# EAGLE design pcb1 (EAGLE 9.4.2)
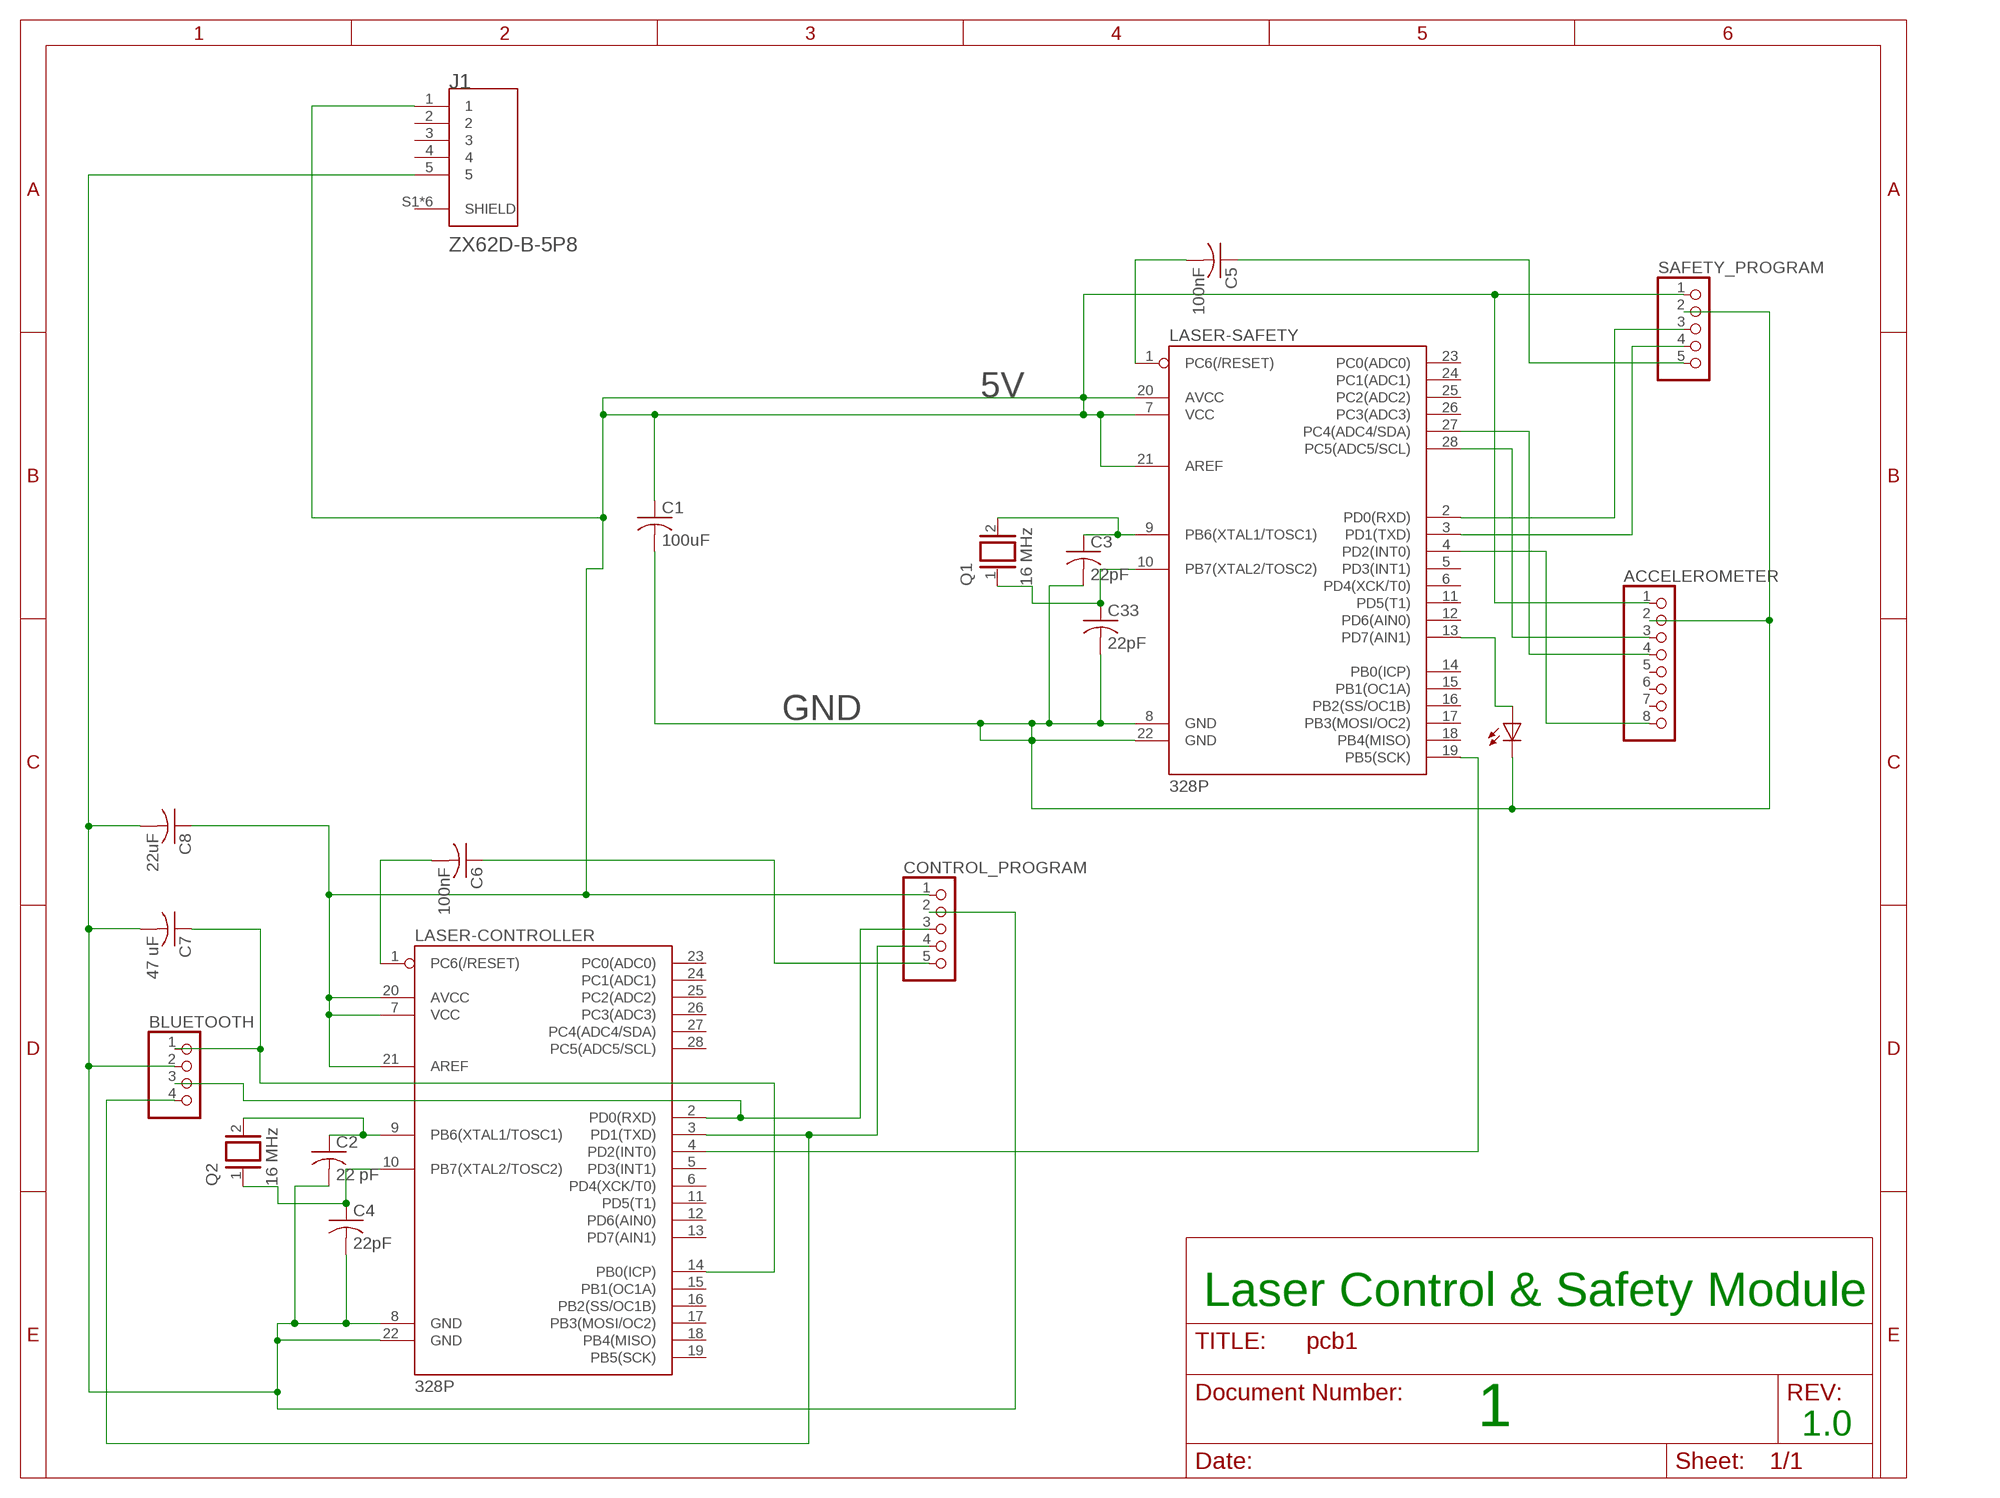
[diagram p0: schematic, sheet 1]

## Parts
ACCELEROMETER  PINHD-1X8  [1X08]
BLUETOOTH  PINHD-1X4  [1X04]
C1  100uF  C-US025-030X050  [C025-030X050]
C2  22 pF  C-US025-025X050  [C025-025X050]
C3  22pF  C-US025-025X050  [C025-025X050]
C4  22pF  C-US025-025X050  [C025-025X050]
C5  100nF  C-US025-025X050  [C025-025X050]
C6  100nF  C-US025-025X050  [C025-025X050]
C7  47 uF  C-US025-024X044  [C025-024X044]
C8  22uF  C-US025-024X044  [C025-024X044]
C33  22pF  C-US025-025X050  [C025-025X050]
CONTROL_PROGRAM  PINHD-1X5  [1X05]
J1  ZX62D-B-5P8  [HRS_ZX62D-B-5P8]
LASER-CONTROLLER  328P  ATMEGA328P_PDIP  [DIP28]
LASER-SAFETY  328P  ATMEGA328P_PDIP  [DIP28]
Q1  16 MHz  XTAL/S  [QS]
Q2  16 MHz  XTAL/S  [QS]
SAFETY_PROGRAM  PINHD-1X5  [1X05]
U$1  LEDLED3MM  [LED3MM]

## Nets
5V: ACCELEROMETER.1 C1.1 C8.1 CONTROL_PROGRAM.1 J1.1 LASER-CONTROLLER.7(VCC) LASER-CONTROLLER.20(AVCC) LASER-CONTROLLER.21(AREF) LASER-SAFETY.7(VCC) LASER-SAFETY.20(AVCC) LASER-SAFETY.21(AREF) SAFETY_PROGRAM.1
GND: ACCELEROMETER.2 BLUETOOTH.2 C1.2 C2.2 C3.2 C4.2 C7.2 C8.2 C33.2 CONTROL_PROGRAM.2 J1.5 LASER-CONTROLLER.8(GND) LASER-CONTROLLER.22(GND) LASER-SAFETY.8(GND) LASER-SAFETY.22(GND) SAFETY_PROGRAM.2 U$1.K(C)
N$1: C4.1 LASER-CONTROLLER.10(PB7(XTAL2/TOSC2)) Q2.1
N$2: LASER-SAFETY.13(PD7(AIN1)) U$1.A
N$3: LASER-CONTROLLER.4(PD2(INT0)) LASER-SAFETY.19(PB5(SCK))
N$4: C5.1 SAFETY_PROGRAM.5
N$5: C5.2 LASER-SAFETY.1(PC6(/RESET))
N$6: C2.1 LASER-CONTROLLER.9(PB6(XTAL1/TOSC1)) Q2.2
N$7: BLUETOOTH.3 CONTROL_PROGRAM.3 LASER-CONTROLLER.2(PD0(RXD))
N$9: BLUETOOTH.4 CONTROL_PROGRAM.4 LASER-CONTROLLER.3(PD1(TXD))
N$11: C6.1 CONTROL_PROGRAM.5
N$12: C6.2 LASER-CONTROLLER.1(PC6(/RESET))
N$13: ACCELEROMETER.3 LASER-SAFETY.28(PC5(ADC5/SCL))
N$14: ACCELEROMETER.4 LASER-SAFETY.27(PC4(ADC4/SDA))
N$15: ACCELEROMETER.8 LASER-SAFETY.4(PD2(INT0))
N$16: BLUETOOTH.1 C7.1 LASER-CONTROLLER.14(PB0(ICP))
N$23: LASER-SAFETY.2(PD0(RXD)) SAFETY_PROGRAM.3
N$24: C33.1 LASER-SAFETY.10(PB7(XTAL2/TOSC2)) Q1.1
N$25: C3.1 LASER-SAFETY.9(PB6(XTAL1/TOSC1)) Q1.2
N$26: LASER-SAFETY.3(PD1(TXD)) SAFETY_PROGRAM.4
Unconnected: ACCELEROMETER.5 ACCELEROMETER.6 ACCELEROMETER.7 J1.2 J1.3 J1.4 J1.S1(SHIELD) J1.S2(SHIELD) J1.S3(SHIELD) J1.S4(SHIELD) J1.S5(SHIELD) J1.S6(SHIELD) LASER-CONTROLLER.5(PD3(INT1)) LASER-CONTROLLER.6(PD4(XCK/T0)) LASER-CONTROLLER.11(PD5(T1)) LASER-CONTROLLER.12(PD6(AIN0)) LASER-CONTROLLER.13(PD7(AIN1)) LASER-CONTROLLER.15(PB1(OC1A)) LASER-CONTROLLER.16(PB2(SS/OC1B)) LASER-CONTROLLER.17(PB3(MOSI/OC2)) LASER-CONTROLLER.18(PB4(MISO)) LASER-CONTROLLER.19(PB5(SCK)) LASER-CONTROLLER.23(PC0(ADC0)) LASER-CONTROLLER.24(PC1(ADC1)) LASER-CONTROLLER.25(PC2(ADC2)) LASER-CONTROLLER.26(PC3(ADC3)) LASER-CONTROLLER.27(PC4(ADC4/SDA)) LASER-CONTROLLER.28(PC5(ADC5/SCL)) LASER-SAFETY.5(PD3(INT1)) LASER-SAFETY.6(PD4(XCK/T0)) LASER-SAFETY.11(PD5(T1)) LASER-SAFETY.12(PD6(AIN0)) LASER-SAFETY.14(PB0(ICP)) LASER-SAFETY.15(PB1(OC1A)) LASER-SAFETY.16(PB2(SS/OC1B)) LASER-SAFETY.17(PB3(MOSI/OC2)) LASER-SAFETY.18(PB4(MISO)) LASER-SAFETY.23(PC0(ADC0)) LASER-SAFETY.24(PC1(ADC1)) LASER-SAFETY.25(PC2(ADC2)) LASER-SAFETY.26(PC3(ADC3))

## Notes on the sheet
- Laser Control & Safety Module
- 1 | 1.0

## Library data of the parts
ACCELEROMETER = pinhead:PINHD-1X8: PIN HEADER
BLUETOOTH = pinhead:PINHD-1X4: PIN HEADER
C1 C3-C8 C33 = rcl:C-US: CAPACITOR, American symbol; SPICEPREFIX: C
C2 = rcl:C-US: CAPACITOR, American symbol; SPICEPREFIX: 22 pF
CONTROL_PROGRAM SAFETY_PROGRAM = pinhead:PINHD-1X5: PIN HEADER
J1 = ZX62D-B-5P8:ZX62D-B-5P8: SMD+DIP Micro USB; MICRO-B-SMD; AVAILABILITY: Unavailable; DESCRIPTION: SMD+DIP Micro USB; MICRO-B-SMD; MF: Hirose; MP: ZX62D-B-5P8; PACKAGE: None; PRICE: None
LASER-CONTROLLER LASER-SAFETY = SparkFun-IC-Microcontroller:ATMEGA328P_PDIP: Atmel 328P Through hole ATMEGA328P uC used in the Arduino 32kb flash, 1k EEPROM, 2k SRAM Datasheet <http://www.sparkfun.com/datasheets/Components/SMD/ATMega328.pdf> SparkFun Products Storefront component: AVR 28 Pin 20MHz 32K 6A/D - ATMega328P <https://www.sparkfun.com/products/9061> (COM-09061) SparkFun Simon Says - Through-Hole Soldering Kit <https://www.sparkfun.com/products/10547> (KIT-10547) SparkFun Learn to Solder - Simon Says <https://www.sparkfun.com/products/13708> (KIT-13708) SparkFun BigTime Watch Kit <https://www.sparkfun.com/products/11734> (KIT-11734) SparkFun ClockIt <https://www.sparkfun.com/products/10930> (KIT-10930) SparkFun Serial Enabled LCD Kit <https://www.sparkfun.com/products/10097> (LCD-10097) SparkFun Simon Tilts - Through Hole Soldering Kit <https://www.sparkfun.com/products/12634> (KIT-12634) SparkFun Frequency Counter Kit <https://www.sparkfun.com/products/10140> (KIT-10140) FabFM Radio Kit <https://www.sparkfun.com/products/11043> (KIT-11043) SparkFun Binary Blaster Kit <https://www.sparkfun.com/products/12037> (KIT-12037) SparkFun Metro-Gnome <https://www.sparkfun.com/products/9236> (KIT-09236) ATmega328 with Arduino Optiboot (Uno) <https://www.sparkfun.com/products/10524> (DEV-10524); PROD_ID: IC-09136
Q1 Q2 = special:XTAL/S: CRYSTAL
U$1 = Clean-Kong:LED

## Board
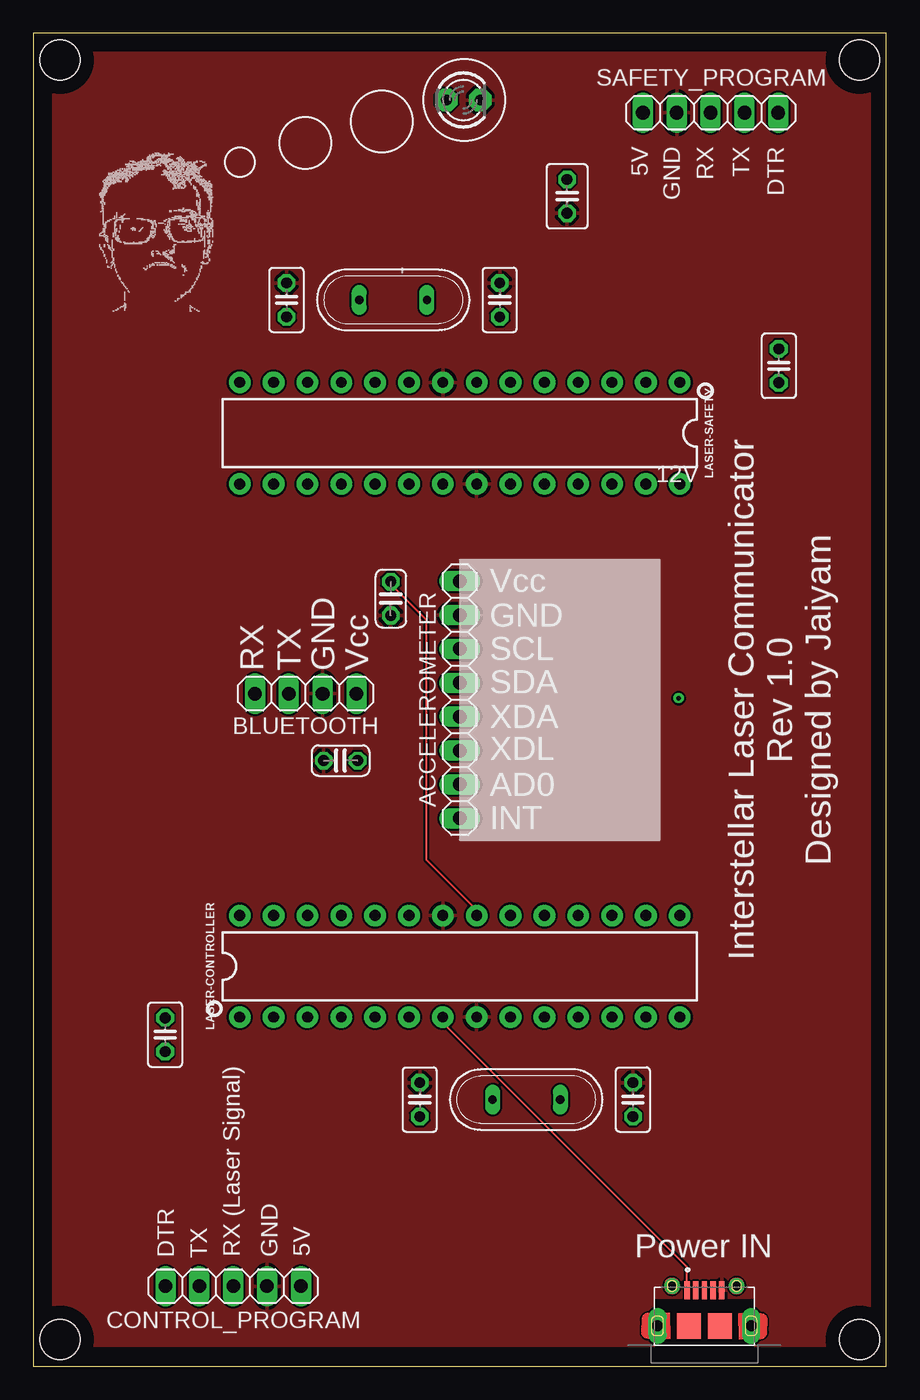
[diagram p1: board, top side]
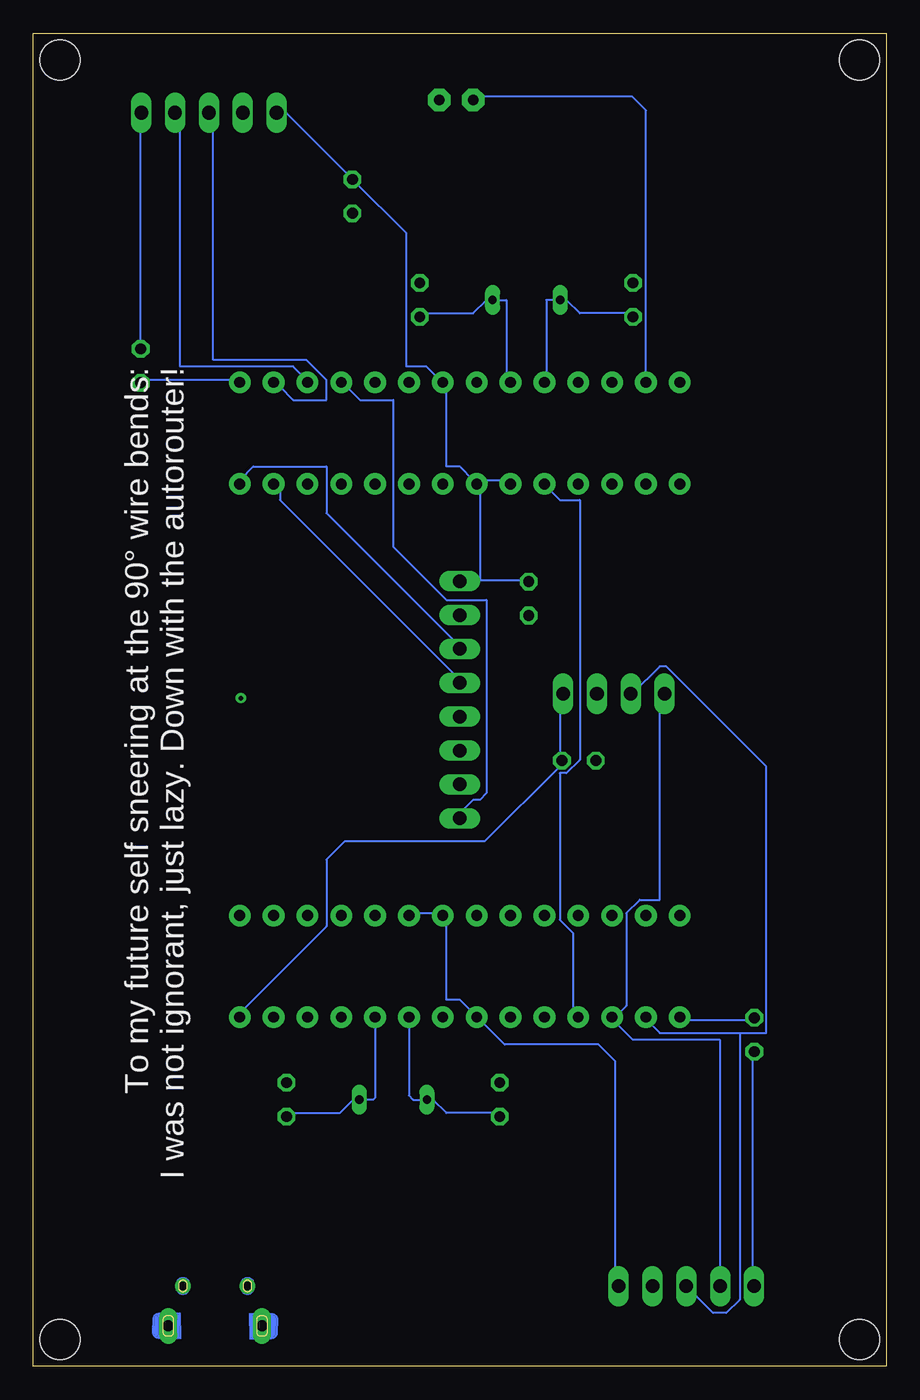
[diagram p2: board, bottom side, seen from below]

Size 64 x 100 mm. Coordinates in mm from the lower left corner, seen from the top.
Outline: 0,0 64,0 64,100 0,100 0,0
Copper layers (1*16): Top 0.035mm / dielectric 1.5mm / Bottom 0.035mm
Design rules "default *": minimum track width 6mil, minimum drill 0.35mm, track to track 6mil, track to pad 6mil, pad to pad 6mil, via to via 6mil, smd to smd 6mil, copper to edge 40mil, drill to drill 6mil, minimum pad ring 10mil, minimum via ring 8mil, stop-mask expansion 4mil, vias tented up to drill 0mil, thermal gap 10mil
Holes 3 mm at 2,2 62,2 62,98 2,98

### Footprints (pad centres in the part's own frame; a part is rotated, then mirrored left to right if it is on the bottom)
1X08 = drill 1.016 long: 1 -8.89,0; 2 -6.35,0; 3 -3.81,0; 4 -1.27,0; 5 1.27,0; 6 3.81,0; 7 6.35,0; 8 8.89,0
1X04 = drill 1.016 long: 1 -3.81,0; 2 -1.27,0; 3 1.27,0; 4 3.81,0
C025-030X050 = drill 0.813 octagon: 1 -1.27,0; 2 1.27,0
C025-025X050 = drill 0.813 octagon: 1 -1.27,0; 2 1.27,0
C025-024X044 = drill 0.813 octagon: 1 -1.27,0; 2 1.27,0
1X05 = drill 1.016 long: 1 -5.08,0; 2 -2.54,0; 3 0,0; 4 2.54,0; 5 5.08,0
HRS_ZX62D-B-5P8 = smd 0.4 x 1.35: 1 -1.3,2.6; 2 -0.65,2.6; 3 0,2.6; 4 0.65,2.6; 5 1.3,2.6 | drill 0.65 pad 1.05: S1 -2.425,2.925; S2 2.425,2.925 | drill 0.825 pad 0.95 long: S3 -3.513,-0.075; S6 3.513,-0.075 | smd 1.8 x 1.9: S4 -1.15,-0.075; S5 1.15,-0.075
DIP28 = drill 0.813 pad 1.626: 1 -16.51,-3.81; 2 -13.97,-3.81; 3 -11.43,-3.81; 4 -8.89,-3.81; 5 -6.35,-3.81; 6 -3.81,-3.81; 7 -1.27,-3.81; 8 1.27,-3.81; 9 3.81,-3.81; 10 6.35,-3.81; 11 8.89,-3.81; 12 11.43,-3.81; 13 13.97,-3.81; 14 16.51,-3.81; 15 16.51,3.81; 16 13.97,3.81; 17 11.43,3.81; 18 8.89,3.81; 19 6.35,3.81; 20 3.81,3.81; 21 1.27,3.81; 22 -1.27,3.81; 23 -3.81,3.81; 24 -6.35,3.81; 25 -8.89,3.81; 26 -11.43,3.81; 27 -13.97,3.81; 28 -16.51,3.81
QS = drill 0.61 long: 1 -2.54,0; 2 2.54,0
LED3MM = drill 0.8 pad 1.676 octagon: A 0,0; K 2.54,0

### Placement (x,y rotation side)
ACCELEROMETER  32,50 270 top
BLUETOOTH  20.44,50.46 180 top
C1  40.05,87.77 270 top
C2  29,20 90 top
C3  35,80 90 top
C4  45,20 90 top
C5  55.94,75.05 270 top
C6  9.89,24.87 90 top
C7  23.06,45.44 180 top
C8  26.82,57.59 270 top
C33  19,80 90 top
CONTROL_PROGRAM  15,6 180 top
J1  50.35,3.09 0 top
LASER-CONTROLLER  32,30 0 top
LASER-SAFETY  32,70 180 top
Q1  27,80 0 top
Q2  37,20 180 top
SAFETY_PROGRAM  50.82,94.04 0 top
U$1  31,95 0 top

### Tracks (layer width: path | path; a pad name or v marks a point on that pad's centre or on a via)
5V
  Top 0.152: J1.1 49,6 49,7.5 31,25.5 31,26 LASER-CONTROLLER.7 | C8.1 27,58.5 29.5,56 29.5,38 33,34.5 33,34 LASER-CONTROLLER.21
  Bottom 0.152: SAFETY_PROGRAM.1 45.5,94 45,94 40.5,89.5 C1.1 40,89 36,85 36,75 34.5,75 33.5,74 LASER-SAFETY.7 33,73.5 33,67.5 32,67.5 31,66.5 LASER-SAFETY.21 | 30.5,59 32,59 ACCELEROMETER.1 30.5,59 | 30.5,59 27,59 C8.1 | LASER-SAFETY.20 28.5,66.5 30.5,66.5 LASER-SAFETY.21 | 30.5,59 30.5,66 LASER-SAFETY.21 | LASER-CONTROLLER.20 35.5,34 33.5,34 LASER-CONTROLLER.21 33,33.5 33,27.5 32,27.5 31,26.5 LASER-CONTROLLER.7 30.5,26 29.55,25.05 29.5,25 28.63,24.13 21.59,24.13 20.32,22.86 20.32,6.24 CONTROL_PROGRAM.1 20.5,6
GND
  pour Top: 1.5,98.56 62.75,98.56 62.75,1.5 1.5,1.5
N$1
  Bottom 0.152: C4.1 45,19 41,19 40,20 Q2.1 38.5,20 38.35,20.15 LASER-CONTROLLER.10
N$2
  Bottom 0.152: LASER-SAFETY.13 18.03,94.23 19.05,95.25 30.75,95.25 U$1.A
N$3
  Bottom 0.152: LASER-CONTROLLER.4 23.5,26.5 23.5,32.5 24.5,33.5 24.5,44.5 24,44.5 23,45.5 23,65 24.5,65 25.5,66 LASER-SAFETY.19
N$4
  Bottom 0.152: C5.1 56,76.5 56,94 SAFETY_PROGRAM.5
N$5
  Bottom 0.152: C5.2 55.5,74 49,74 LASER-SAFETY.1
N$6
  Bottom 0.152: C2.1 29,19 33,19 34,20 Q2.2 35.5,20 35.81,20.31 LASER-CONTROLLER.9
N$7
  Bottom 0.152: CONTROL_PROGRAM.3 13,4 12,4 11,5 11,25 | 11,25 17,25 18,26 LASER-CONTROLLER.2 | 11,25 9,25 9,45 16.5,52.5 17,52.5 19,50.5 BLUETOOTH.3
N$8  (via drill 0.35)
  other vias: 48.42,50.12
N$9
  Bottom 0.152: CONTROL_PROGRAM.4 12.5,6 12.5,24.5 19,24.5 20.57,26.07 LASER-CONTROLLER.3 20.34,26.19 19.5,27.04 19.5,34 18.5,35 17,35 17,50 BLUETOOTH.4
N$11
  Bottom 0.152: C6.1 10,23.5 10,6 CONTROL_PROGRAM.5
N$12
  Bottom 0.152: C6.2 10,26 15,26 LASER-CONTROLLER.1
N$13
  Bottom 0.152: ACCELEROMETER.3 32,54 42,64 42,67.5 47.5,67.5 48.5,66.5 LASER-SAFETY.28
N$14
  Bottom 0.152: ACCELEROMETER.4 32,51.5 45.5,65 45.5,66 LASER-SAFETY.27
N$15
  Bottom 0.152: ACCELEROMETER.8 32,41.5 31,42.5 30.5,42.5 30,43 30,57.5 33,57.5 37,61.5 37,72.5 39.5,72.5 40.5,73.5 LASER-SAFETY.4
N$16
  Bottom 0.152: BLUETOOTH.1 24.5,50 24.5,45.5 C7.1 24.5,45 30.13,39.37 40.64,39.37 42,38.01 42,33 48.5,26.5 LASER-CONTROLLER.14
N$23
  Bottom 0.152: SAFETY_PROGRAM.3 50.5,94 50.5,75.5 43.5,75.5 42,74 42,72.5 44.5,72.5 45.5,73.5 LASER-SAFETY.2
N$24
  Bottom 0.152: C33.1 19,79 23,79 24,80 Q1.1 25.5,80 25.5,74 LASER-SAFETY.10
N$25
  Bottom 0.152: C3.1 35,79 31,79 30,80 Q1.2 28.5,80 28.5,74 LASER-SAFETY.9
N$26
  Bottom 0.152: SAFETY_PROGRAM.4 53,94 53,75 44.5,75 43.5,74 LASER-SAFETY.3

### Text on the board
tPlace: Vcc | GND | SCL | RX | TX | GND | Vcc | SDA | Interstellar Laser Communicator / Rev 1.0 / Designed by Jaiyam | XDA | XDL | AD0 | INT
bPlace: To my future self sneering at the 90° wire bends: / I was not ignorant, just lazy. Down with the autorouter!
tNames: 5V | GND | RX | TX | DTR | 12V | Power IN | DTR | TX | RX (Laser Signal) | GND | 5V